# Altium schematic sheet QSPI.SchDoc
size 209 x 297 mm; SheetNumber: 3; SheetTotal: 6
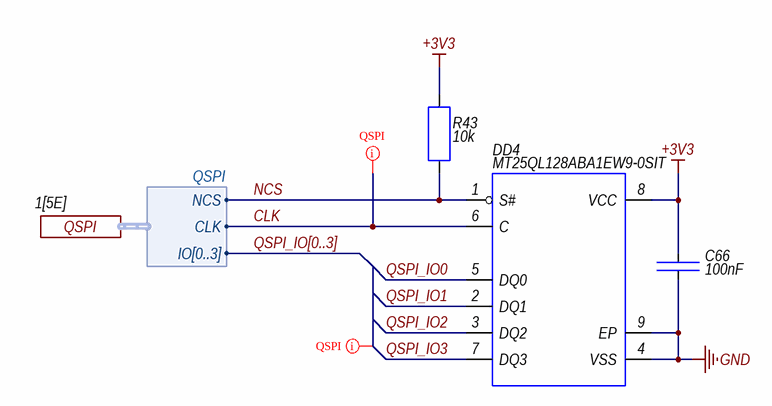
[diagram p0: QSPI.SchDoc]

## Parts
C66  Capacitance: 100nF  [Capacitor 0402]  (hidden comment: Конденсатор керам. ЧИП X5R, 10%, 0402, 0.1 мкФ)
DD4  Device: MT25QL128ABA1EW9-0SIT  [8-SON]  (hidden comment: Микросхема MT25QL128ABA1EW9-0SIT)
R43  Device: 10k  [SMD_0402]

## Ports
QSPI (harness QSPI, see 1[5E])

## Harnesses
QSPI: CLK, NCS, IO[0..3]

## Nets
+3V3: C66.1 DD4.8(VCC) R43.1
GND: C66.2 DD4.4(VSS) DD4.9(EP)
CLK: DD4.6(C) ; port QSPI.CLK
NCS: DD4.1(S#) R43.2 ; port QSPI.NCS
QSPI_IO0: DD4.5(DQ0)
QSPI_IO1: DD4.2(DQ1)
QSPI_IO2: DD4.3(DQ2)
QSPI_IO3: DD4.7(DQ3)

## Buses and harness runs
bus QSPI_IO[0..3]

## Layout directives
net class QUAD_QSPI; rule Matched Net Lengths [Delay Tolerance = 200ps]: (no net found under the mark), CLK

## Notes on the sheet
- Подп. и дата
- Инв. № дубл.
- Взам. инв. №
- Инв. № подл.
- Изм.
- Лист
- № докум.
- Подп.
- Дата
- Копировал
- Формат А4

## Library data of the parts
C66 = 000821-3: Cap Ceramic 0.1uF 50V X5R 10% Pad SMD 0402 85C T/R; Manufacturer: Murata Manufacturing; Manufacturer Part Number: GRM155R61H104KE14J; Device: 100nFx50V; PCAD Reader Code: 0; Info: 100nFx50V; Voltage: 50V; Case: 0402; Pin Count: 2; Help URL: https://www.digikey.com/en/products/detail/murata-electronics/GRM155R61H104KE14J/4905153; Storage Code: 0; Dielectric: X5R; Tolerance: 10%
DD4 = 000992-2: Micron Serial NOR Flash Memory; PCAD Reader Code: 0; Info: MT25QL128ABA1EW9-0SIT; Manufacturer: Micron; Case: SON-8; Manufacturer Part Number: MT25QL128ABA1EW9-0SIT; Storage Code: 0; Pin Count: 8
R43 = Resistor_0402: Part Number: Resistor_0402; Info: 10k; Resistance: 10k; Pin Count: 2